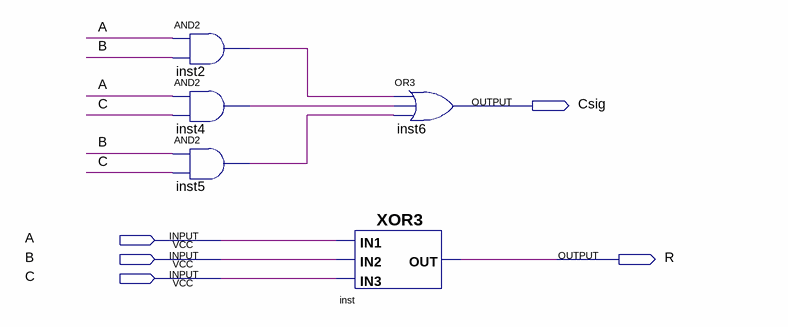
[diagram p0: schematic sheet]
// Quartus schematic FullAdder1Bit.bdf as structural Verilog: 5 symbols, 5 pins
module FullAdder1Bit (
  input  A,
  input  B,
  input  C,
  output Csig,
  output R
);

  wire inst2_out, inst4_out, inst5_out;

  and inst2 (inst2_out, A, B);
  and inst4 (inst4_out, A, C);
  and inst5 (inst5_out, B, C);
  XOR3 inst (.IN3(C), .IN1(A), .IN2(B), .OUT(R));
  or inst6 (Csig, inst2_out, inst4_out, inst5_out);
endmodule
